# Altium schematic sheet Moisture.SchDoc
size A
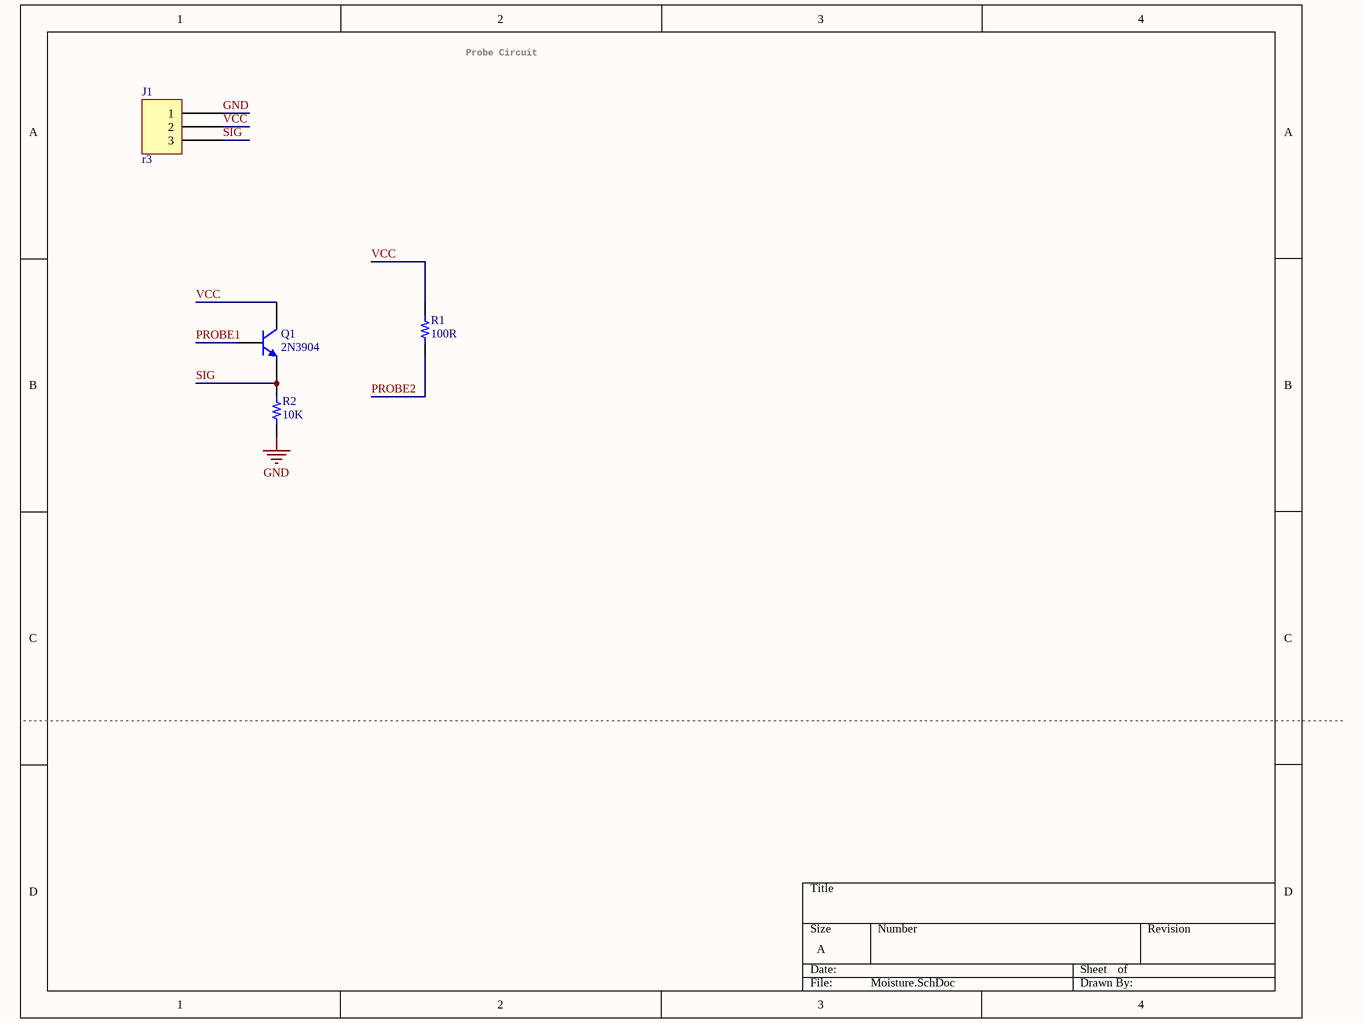
[diagram p0: Moisture.SchDoc]

## Parts
J1  r3  [MOLEX SDA-70553-3PIN]
Q1  2N3904  [SOT23]
R1  100R  [RES 1206/3216]
R2  10K  [RES 1206/3216]

## Nets
GND: J1.1 R2.1
PROBE1: Q1.B
PROBE2: R1.1
SIG: J1.3 Q1.E R2.2
VCC: J1.2 Q1.C R1.2

## Notes on the sheet
- Probe Circuit

## Library data of the parts
Q1 = 2N2222: NPN; E-mail: picpars@gmail.com; De: Seyed Mohsen Ghasemian; web: www.picpars.com
R1 R2 = Resistor: SMT Resistor; Value: 1K